# EAGLE schematic Backplane (EAGLE 9.6.2)
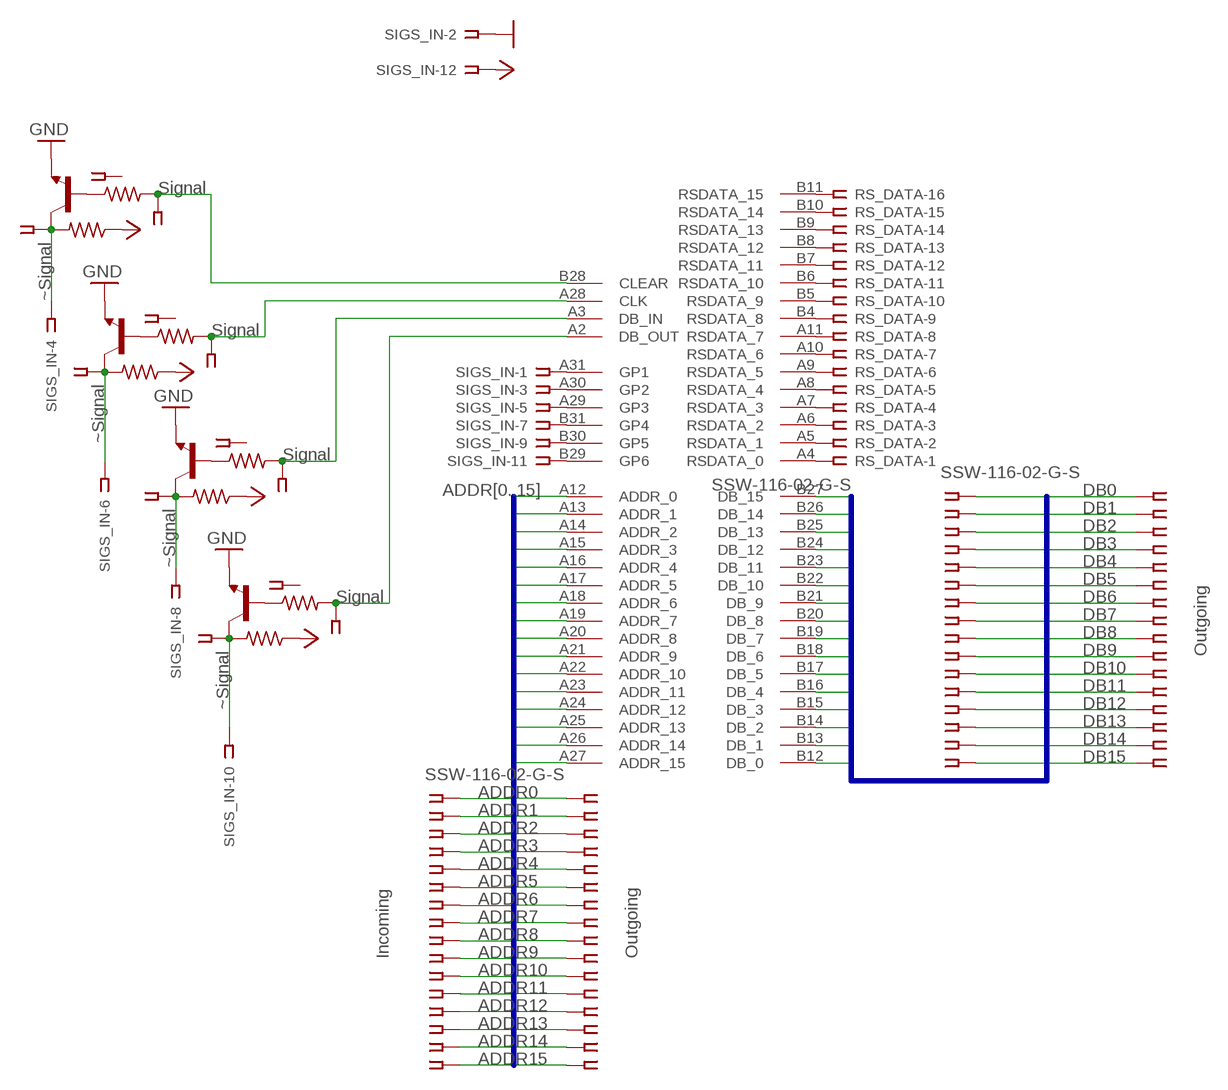
[diagram p0: schematic, sheet 1]

## Parts
ADDR_INCOMING  SSW-116-02-G-S  [SSW-116-02-G-S]
ADDR_OUTGOING  SSW-116-02-G-S-RA  [SSW-116-02-G-S-RA]
DB_INCOMING  SSW-116-02-G-S  [SSW-116-02-G-S]
DB_OUTGOING  SSW-116-02-G-S-RA  [SSW-116-02-G-S-RA]
NO_INVERT_JUMPER  SSW-103-02-G-S  [SSW-103-02-G-S]
NO_INVERT_JUMPER1  SSW-103-02-G-S  [SSW-103-02-G-S]
NO_INVERT_JUMPER2  SSW-103-02-G-S  [SSW-103-02-G-S]
NO_INVERT_JUMPER3  SSW-103-02-G-S  [SSW-103-02-G-S]
R1  ~220  R-US_0204/7  [0204/7]
R2  ~220  R-US_0204/7  [0204/7]
R3  ~220  R-US_0204/7  [0204/7]
R4  ~220  R-US_0204/7  [0204/7]
R5  ~220  R-US_0204/7  [0204/7]
R6  ~220  R-US_0204/7  [0204/7]
R7  ~220  R-US_0204/7  [0204/7]
R8  ~220  R-US_0204/7  [0204/7]
RS_DATA  SSW-116-02-G-S  [SSW-116-02-G-S]
SIGS_IN  SSW-106-02-G-D  [SSW-106-02-G-D]
T1  2N3565  [TO92]
T2  2N3565  [TO92]
T3  2N3565  [TO92]
T4  2N3565  [TO92]
U$1  BACKPLATE_INTERFACEHEADER  [PCI_INTERFACE]

## Nets
ADDR0: ADDR_INCOMING.1 ADDR_OUTGOING.16 U$1.A12(ADDR_0)
ADDR1: ADDR_INCOMING.2 ADDR_OUTGOING.15 U$1.A13(ADDR_1)
ADDR2: ADDR_INCOMING.3 ADDR_OUTGOING.14 U$1.A14(ADDR_2)
ADDR3: ADDR_INCOMING.4 ADDR_OUTGOING.13 U$1.A15(ADDR_3)
ADDR4: ADDR_INCOMING.5 ADDR_OUTGOING.12 U$1.A16(ADDR_4)
ADDR5: ADDR_INCOMING.6 ADDR_OUTGOING.11 U$1.A17(ADDR_5)
ADDR6: ADDR_INCOMING.7 ADDR_OUTGOING.10 U$1.A18(ADDR_6)
ADDR7: ADDR_INCOMING.8 ADDR_OUTGOING.9 U$1.A19(ADDR_7)
ADDR8: ADDR_INCOMING.9 ADDR_OUTGOING.8 U$1.A20(ADDR_8)
ADDR9: ADDR_INCOMING.10 ADDR_OUTGOING.7 U$1.A21(ADDR_9)
ADDR10: ADDR_INCOMING.11 ADDR_OUTGOING.6 U$1.A22(ADDR_10)
ADDR11: ADDR_INCOMING.12 ADDR_OUTGOING.5 U$1.A23(ADDR_11)
ADDR12: ADDR_INCOMING.13 ADDR_OUTGOING.4 U$1.A24(ADDR_12)
ADDR13: ADDR_INCOMING.14 ADDR_OUTGOING.3 U$1.A25(ADDR_13)
ADDR14: ADDR_INCOMING.15 ADDR_OUTGOING.2 U$1.A26(ADDR_14)
ADDR15: ADDR_INCOMING.16 ADDR_OUTGOING.1 U$1.A27(ADDR_15)
DB0: DB_INCOMING.1 DB_OUTGOING.16 U$1.B12(DB_0)
DB1: DB_INCOMING.2 DB_OUTGOING.15 U$1.B13(DB_1)
DB2: DB_INCOMING.3 DB_OUTGOING.14 U$1.B14(DB_2)
DB3: DB_INCOMING.4 DB_OUTGOING.13 U$1.B15(DB_3)
DB4: DB_INCOMING.5 DB_OUTGOING.12 U$1.B16(DB_4)
DB5: DB_INCOMING.6 DB_OUTGOING.11 U$1.B17(DB_5)
DB6: DB_INCOMING.7 DB_OUTGOING.10 U$1.B18(DB_6)
DB7: DB_INCOMING.8 DB_OUTGOING.9 U$1.B19(DB_7)
DB8: DB_INCOMING.9 DB_OUTGOING.8 U$1.B20(DB_8)
DB9: DB_INCOMING.10 DB_OUTGOING.7 U$1.B21(DB_9)
DB10: DB_INCOMING.11 DB_OUTGOING.6 U$1.B22(DB_10)
DB11: DB_INCOMING.12 DB_OUTGOING.5 U$1.B23(DB_11)
DB12: DB_INCOMING.13 DB_OUTGOING.4 U$1.B24(DB_12)
DB13: DB_INCOMING.14 DB_OUTGOING.3 U$1.B25(DB_13)
DB14: DB_INCOMING.15 DB_OUTGOING.2 U$1.B26(DB_14)
DB15: DB_INCOMING.16 DB_OUTGOING.1 U$1.B27(DB_15)
GND: SIGS_IN.2 T1.3(E) T2.3(E) T3.3(E) T4.3(E)
N$1: SIGS_IN.1 U$1.A31(GP1)
N$2: R8.1 T1.2(B)
N$3: SIGS_IN.3 U$1.A30(GP2)
N$4: SIGS_IN.5 U$1.A29(GP3)
N$5: SIGS_IN.7 U$1.B31(GP4)
N$6: SIGS_IN.9 U$1.B30(GP5)
N$7: SIGS_IN.11 U$1.B29(GP6)
N$8: NO_INVERT_JUMPER.2 R8.2 U$1.B28(CLEAR)
N$9: NO_INVERT_JUMPER.3 R1.2 SIGS_IN.4 T1.1(C)
N$10: R2.1 T2.2(B)
N$11: NO_INVERT_JUMPER1.2 R2.2 U$1.A28(CLK)
N$12: NO_INVERT_JUMPER1.3 R3.2 SIGS_IN.6 T2.1(C)
N$13: R4.1 T3.2(B)
N$14: NO_INVERT_JUMPER2.2 R4.2 U$1.A3(DB_IN)
N$15: NO_INVERT_JUMPER2.3 R5.2 SIGS_IN.8 T3.1(C)
N$16: R6.1 T4.2(B)
N$17: NO_INVERT_JUMPER3.2 R6.2 U$1.A2(DB_OUT)
N$18: NO_INVERT_JUMPER3.3 R7.2 SIGS_IN.10 T4.1(C)
N$19: RS_DATA.1 U$1.A4(RSDATA_0)
N$20: RS_DATA.2 U$1.A5(RSDATA_1)
N$21: RS_DATA.3 U$1.A6(RSDATA_2)
N$22: RS_DATA.4 U$1.A7(RSDATA_3)
N$23: RS_DATA.5 U$1.A8(RSDATA_4)
N$24: RS_DATA.6 U$1.A9(RSDATA_5)
N$25: RS_DATA.7 U$1.A10(RSDATA_6)
N$26: RS_DATA.8 U$1.A11(RSDATA_7)
N$27: RS_DATA.9 U$1.B4(RSDATA_8)
N$28: RS_DATA.10 U$1.B5(RSDATA_9)
N$29: RS_DATA.11 U$1.B6(RSDATA_10)
N$30: RS_DATA.12 U$1.B7(RSDATA_11)
N$31: RS_DATA.13 U$1.B8(RSDATA_12)
N$32: RS_DATA.14 U$1.B9(RSDATA_13)
N$33: RS_DATA.15 U$1.B10(RSDATA_14)
N$34: RS_DATA.16 U$1.B11(RSDATA_15)
VCC: R1.1 R3.1 R5.1 R7.1 SIGS_IN.12
Unconnected: NO_INVERT_JUMPER1.1 NO_INVERT_JUMPER2.1 NO_INVERT_JUMPER3.1 NO_INVERT_JUMPER.1 U$1.B2 U$1.B3

## Buses
DB[0..15]
ADDR[0..15]

## Notes on the sheet
- Signal
- ~Signal
- Signal
- ~Signal
- Signal
- ~Signal
- Signal
- Outgoing
- ~Signal
- Incoming | Outgoing

## Power pins joined to a net without a drawn wire
GND: U$1.B1(GND) U$1.B32(GND)
VCC: U$1.A1(VCC) U$1.A32(VCC)

## Library data of the parts
ADDR_INCOMING DB_INCOMING RS_DATA = con-samtec:SSW-116-02-G-S: THROUGH-HOLE .025" SQ POST SOCKET Source: Samtec SSW.pdf; MF: Samtec Inc.; MPN: SSW-116-02-G-S; OC_FARNELL: unknown; OC_NEWARK: 29C5896
ADDR_OUTGOING DB_OUTGOING = con-samtec:SSW-116-02-G-S: THROUGH-HOLE .025" SQ POST SOCKET Source: Samtec SSW.pdf; MF: Samtec Inc.; MPN: SSW-116-02-G-S-RA; OC_FARNELL: unknown; OC_NEWARK: 11P9579
NO_INVERT_JUMPER NO_INVERT_JUMPER1-NO_INVERT_JUMPER3 = con-samtec:SSW-103-02-G-S: THROUGH-HOLE .025" SQ POST SOCKET Source: Samtec SSW.pdf; MF: Samtec Inc.; MPN: SSW-103-02-G-S; OC_FARNELL: unknown; OC_NEWARK: 11P9367
R1-R8 = rcl:R-US_: RESISTOR, American symbol; SPICEPREFIX: R
SIGS_IN = con-samtec:SSW-106-02-G: THROUGH-HOLE .025" SQ POST SOCKET Source: Samtec SSW.pdf; MF: Samtec Inc.; MPN: SSW-106-02-G-D; OC_FARNELL: unknown; OC_NEWARK: 11P9414
T1-T4 = transistor:2N3565: NPN TRANSISTOR
U$1 = Computer:BACKPLATE_INTERFACE